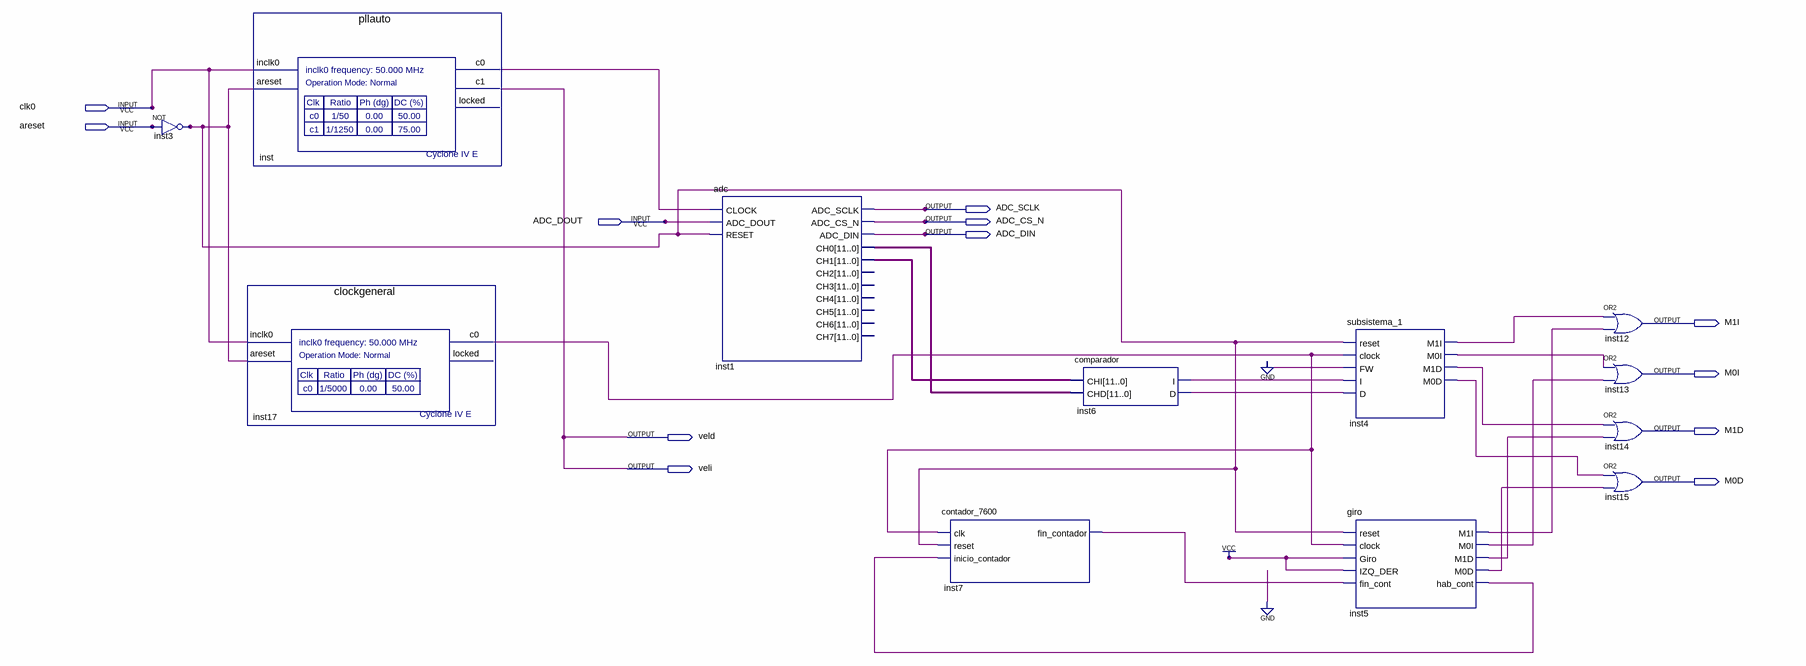
[diagram p0: schematic sheet]
// Quartus schematic Main_Esquematico.bdf as structural Verilog: 12 symbols, 12 pins
module Main_Esquematico (
  input  clk0,
  input  areset,
  input  ADC_DOUT,
  output ADC_SCLK,
  output ADC_CS_N,
  output ADC_DIN,
  output M1I,
  output M0I,
  output M1D,
  output veld,
  output veli,
  output M0D
);

  wire inst3_out, inst4_m0d, inst4_m0i, inst4_m1d, inst4_m1i, inst5_hab_cont, inst5_m0d, inst5_m0i,
       inst5_m1d, inst5_m1i, inst6_d, inst6_i, inst7_fin_contador, inst17_c0, inst_c0;
  wire [11:0] inst1_ch0, inst1_ch1;

  not inst3 (inst3_out, areset);
  pllauto inst (.inclk0(clk0), .areset(inst3_out), .c0(inst_c0), .c1(veld));  // open: locked
  clockgeneral inst17 (.inclk0(clk0), .areset(inst3_out), .c0(inst17_c0));  // open: locked
  adc inst1 (
    .CLOCK(inst_c0), .ADC_DOUT(ADC_DOUT), .RESET(inst3_out), .ADC_SCLK(ADC_SCLK), .ADC_CS_N(ADC_CS_N),
    .ADC_DIN(ADC_DIN), .CH0(inst1_ch0), .CH1(inst1_ch1));  // open: CH2, CH3, CH4, CH5, CH6, CH7
  contador_7600 inst7 (
    .clk(inst17_c0), .reset(inst3_out), .inicio_contador(inst5_hab_cont), .fin_contador(inst7_fin_contador));
  comparador inst6 (.CHI(inst1_ch1), .CHD(inst1_ch0), .I(inst6_i), .D(inst6_d));
  subsistema_1 inst4 (
    .reset(inst3_out), .clock(inst17_c0), .FW(1'b0), .I(inst6_i), .D(inst6_d), .M1I(inst4_m1i),
    .M0I(inst4_m0i), .M1D(inst4_m1d), .M0D(inst4_m0d));
  giro inst5 (
    .reset(inst3_out), .clock(inst17_c0), .Giro(1'b1), .IZQ_DER(1'b1), .fin_cont(inst7_fin_contador),
    .M1I(inst5_m1i), .M0I(inst5_m0i), .M1D(inst5_m1d), .M0D(inst5_m0d), .hab_cont(inst5_hab_cont));
  or inst12 (M1I, inst4_m1i, inst5_m1i);
  or inst13 (M0I, inst4_m0i, inst5_m0i);
  or inst14 (M1D, inst4_m1d, inst5_m1d);
  or inst15 (M0D, inst4_m0d, inst5_m0d);

  assign veli = veld;
endmodule
